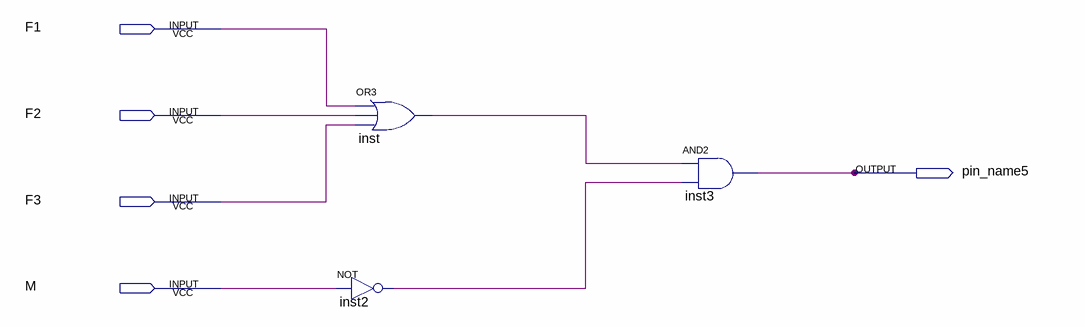
[diagram p0: schematic sheet]
// Quartus schematic Block2.bdf as structural Verilog: 3 symbols, 5 pins
module Block2 (
  input  F1,
  input  F2,
  input  F3,
  input  M,
  output pin_name5
);

  wire inst2_out, inst_out;

  or inst (inst_out, F1, F2, F3);
  not inst2 (inst2_out, M);
  and inst3 (pin_name5, inst_out, inst2_out);
endmodule
